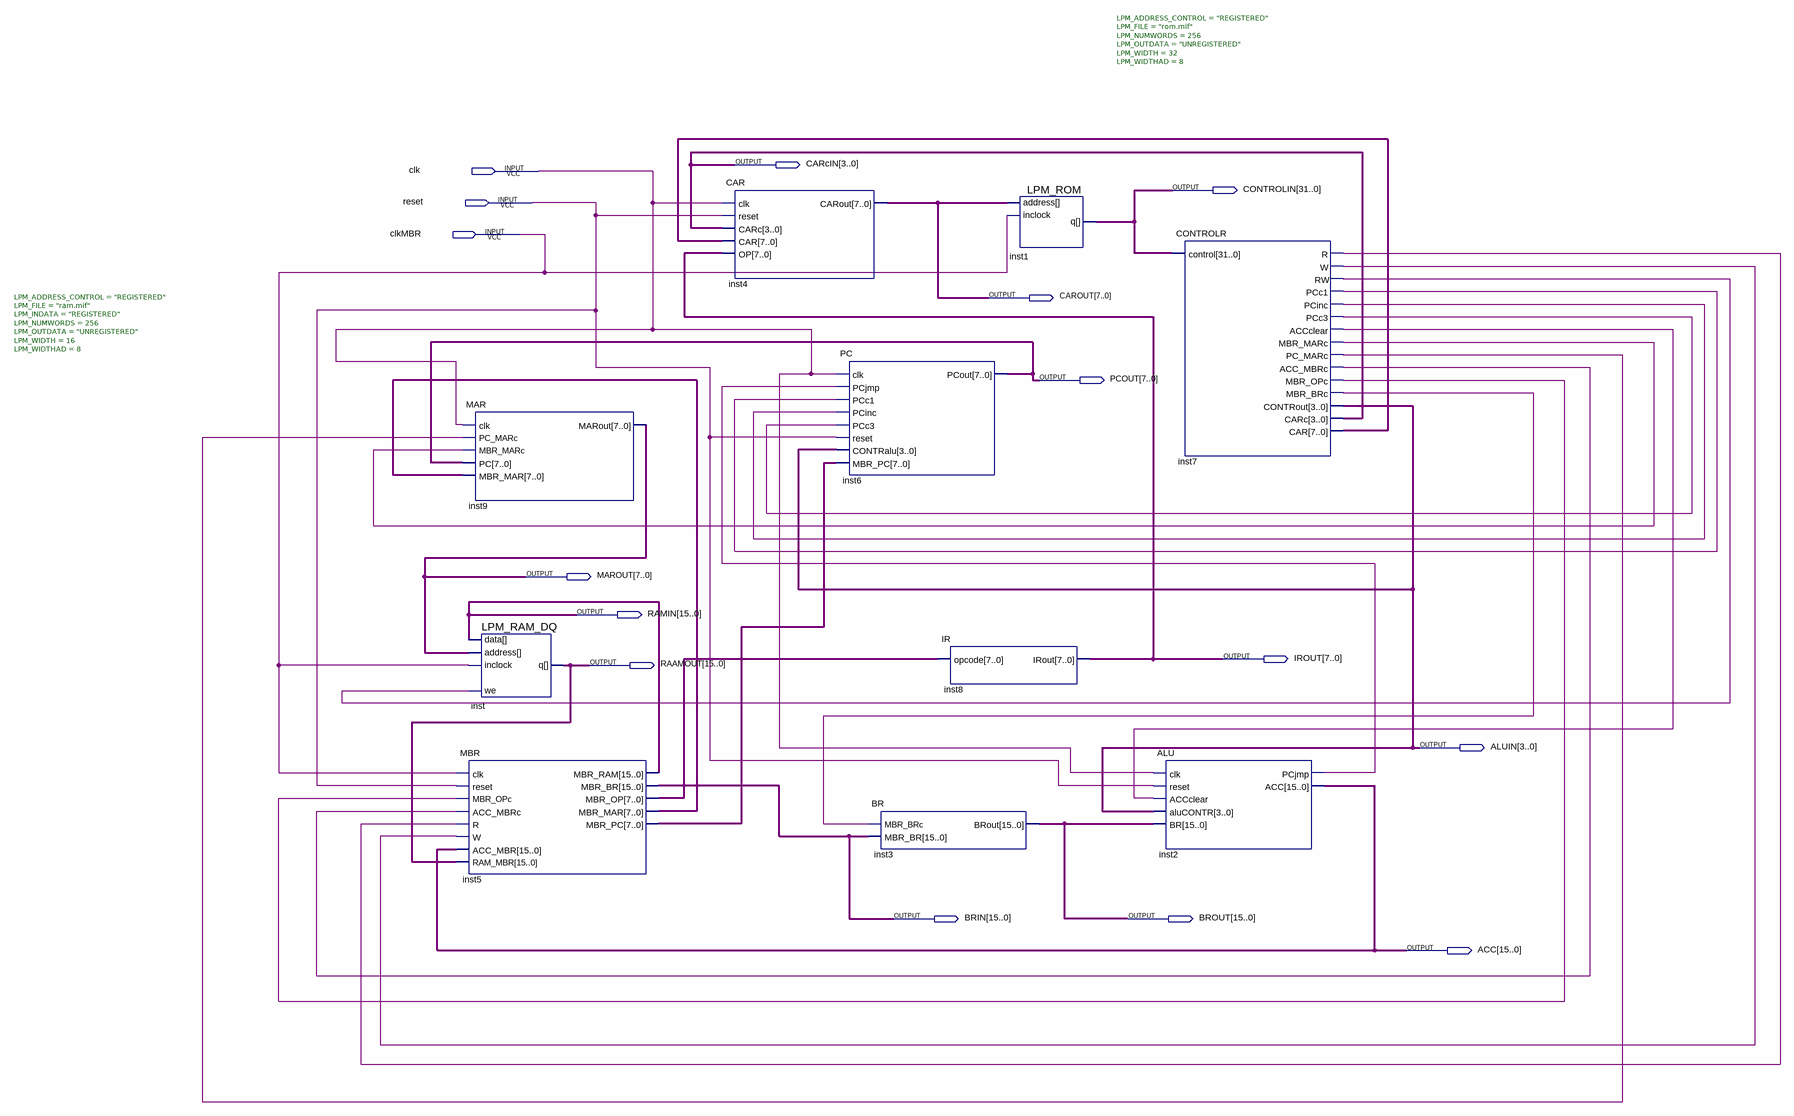
[diagram p0: schematic sheet]
// Quartus schematic top.bdf as structural Verilog: 10 symbols, 15 pins
module top (
  input  clk,
  input  reset,
  input  clkMBR,
  output [3:0] CARcIN,
  output [31:0] CONTROLIN,
  output [7:0] CAROUT,
  output [7:0] PCOUT,
  output [7:0] MAROUT,
  output [15:0] RAMIN,
  output [7:0] IROUT,
  output [15:0] RAAMOUT,
  output [3:0] ALUIN,
  output [15:0] BRIN,
  output [15:0] BROUT,
  output [15:0] ACC
);

  wire inst2_pcjmp, inst7_acc_mbrc, inst7_accclear, inst7_mbr_brc, inst7_mbr_marc, inst7_mbr_opc,
       inst7_pc_marc, inst7_pcc1, inst7_pcc3, inst7_pcinc, inst7_r, inst7_rw, inst7_w;
  wire [7:0] inst5_mbr_mar, inst5_mbr_op, inst5_mbr_pc, inst7_car;

  MBR inst5 (
    .clk(clkMBR), .reset(reset), .MBR_OPc(inst7_mbr_opc), .ACC_MBRc(inst7_acc_mbrc), .R(inst7_r),
    .W(inst7_w), .ACC_MBR(ACC), .RAM_MBR(RAAMOUT), .MBR_RAM(RAMIN), .MBR_BR(BRIN), .MBR_OP(inst5_mbr_op),
    .MBR_MAR(inst5_mbr_mar), .MBR_PC(inst5_mbr_pc));
  MAR inst9 (
    .clk(clk), .PC_MARc(inst7_pc_marc), .MBR_MARc(inst7_mbr_marc), .PC(PCOUT), .MBR_MAR(inst5_mbr_mar),
    .MARout(MAROUT));
  LPM_RAM_DQ #(.LPM_ADDRESS_CONTROL("REGISTERED"), .LPM_FILE("ram.mif"), .LPM_INDATA("REGISTERED"), .LPM_NUMWORDS(256), .LPM_OUTDATA("UNREGISTERED"), .LPM_WIDTH(16), .LPM_WIDTHAD(8)) inst (
    .address(MAROUT), .data(RAMIN), .inclock(clkMBR), .we(inst7_rw), .q(RAAMOUT));
  CAR inst4 (.clk(clk), .reset(reset), .CARc(CARcIN), .CAR(inst7_car), .OP(IROUT), .CARout(CAROUT));
  PC inst6 (
    .clk(clk), .PCjmp(inst2_pcjmp), .PCc1(inst7_pcc1), .PCinc(inst7_pcinc), .PCc3(inst7_pcc3), .reset(reset),
    .CONTRalu(ALUIN), .MBR_PC(inst5_mbr_pc), .PCout(PCOUT));
  BR inst3 (.MBR_BRc(inst7_mbr_brc), .MBR_BR(BRIN), .BRout(BROUT));
  IR inst8 (.opcode(inst5_mbr_op), .IRout(IROUT));
  LPM_ROM #(.LPM_ADDRESS_CONTROL("REGISTERED"), .LPM_FILE("rom.mif"), .LPM_NUMWORDS(256), .LPM_OUTDATA("UNREGISTERED"), .LPM_WIDTH(32), .LPM_WIDTHAD(8)) inst1 (
    .address(CAROUT), .inclock(clkMBR), .q(CONTROLIN));
  ALU inst2 (
    .clk(clk), .reset(reset), .ACCclear(inst7_accclear), .aluCONTR(ALUIN), .BR(BROUT), .PCjmp(inst2_pcjmp),
    .ACC(ACC));
  CONTROLR inst7 (
    .control(CONTROLIN), .R(inst7_r), .W(inst7_w), .RW(inst7_rw), .PCc1(inst7_pcc1), .PCinc(inst7_pcinc),
    .PCc3(inst7_pcc3), .ACCclear(inst7_accclear), .MBR_MARc(inst7_mbr_marc), .PC_MARc(inst7_pc_marc),
    .ACC_MBRc(inst7_acc_mbrc), .MBR_OPc(inst7_mbr_opc), .MBR_BRc(inst7_mbr_brc), .CONTRout(ALUIN),
    .CARc(CARcIN), .CAR(inst7_car));
endmodule
